# EAGLE schematic Module (EAGLE 9.5.2)

## Sheet 1 of 4: Regulator General
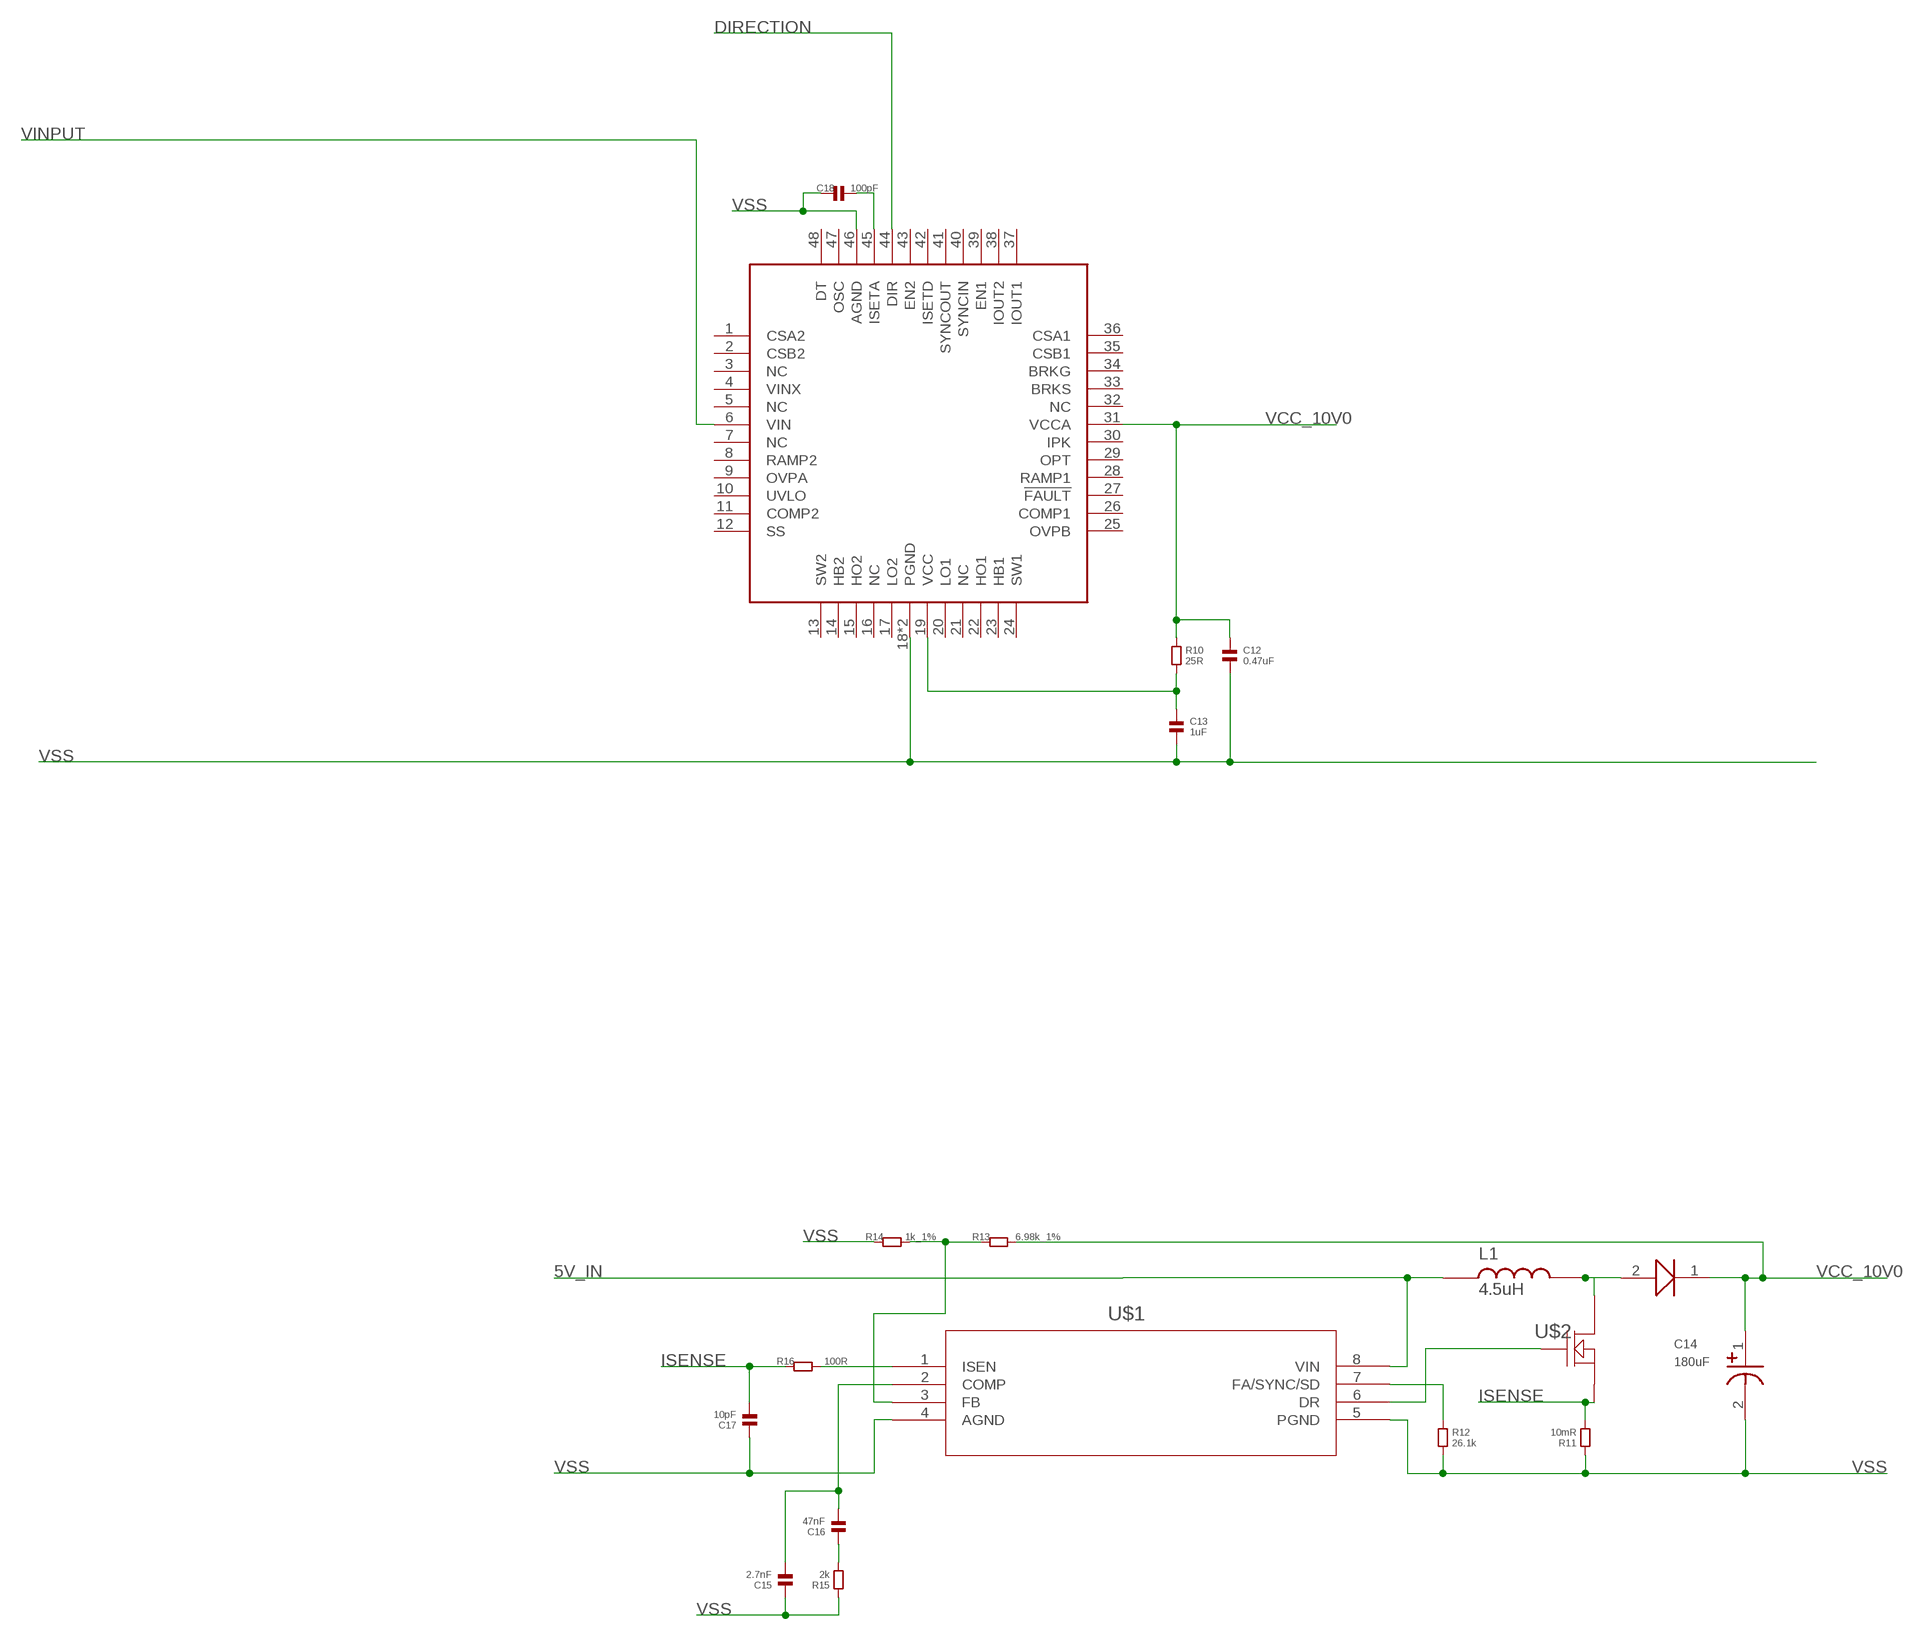
[diagram p0: schematic, sheet 1]

### Parts
C12  0.47uF  CAPACITOR.0603  [0603]
C13  1uF  CAPACITOR.0603  [0603]
C14  180uF  CAPACITOR_POLARIZED6  [ALUMINUM_ELECTROLYTIC_POLARIZED-2.5P_6.3D_11H]
C15  2.7nF  CAPACITOR.0603  [0603]
C16  47nF  CAPACITOR.0603  [0603]
C17  10pF  CAPACITOR.0603  [0603]
C18  100pF  CAPACITOR.0603  [0603]
D1  DIODES_INC-DIODE-B540C-13-F  [DIODES_INCORPORATED-DIODE-B540C-13-F]
L1  4.5uH  BOURNS-INDUCTOR-SRR1208-4R5ML  [BOURNS-INDUCTOR-SRR1208-4R5ML]
R10  25R  RESISTOR.0603  [0603]
R11  10mR  RESISTOR.1206  [1206]
R12  26.1k  RESISTOR.0603  [0603]
R13  6.98k_1%  RESISTOR.0603  [0603]
R14  1k_1%  RESISTOR.0603  [0603]
R15  2k  RESISTOR.0603  [0603]
R16  100R  RESISTOR.0603  [0603]
U1  TEXAS_INSTRUMENTS-BUCK_BOOST_CONTROLLER-LM5170  [TEXAS_INSTRUMENTS-BUCK-BOOST-CONTROLLER-LM5170]
U$1  TEXAS_INSTRUMENTS-BOOST_CONTROLLER-LM3488_DGK_8  [TEXAS_INSTRUMENTS-BOOST_CONTROLLER-LM3488_DGK_8]
U$2  TEXAS_INSTRUMENTS-MOSFET-CSD17571Q2  [TEXAS_INSTRUMENTS-MOSFET-CSD17571Q2]

### Nets
5V_IN: L1.1 U$1.8(VIN) ; also sheet 4
DIRECTION: U1.44(DIR)
ISENSE: C17.2 R11.2 R16.1 U$2.4(SOURCE_2)
N$1: D1.2(CATHODE) L1.2 U$2.1(DRAIN_2)
N$11: U$1.6(DR) U$2.3(GATE)
N$12: C13.1 R10.2 U1.19(VCC)
N$13: C18.2 U1.45(ISETA)
N$14: R12.1 U$1.7(FA/SYNC/SD)
N$15: R13.1 R14.2 U$1.3(FB)
N$16: C16.1 R15.2
N$17: C15.2 C16.2 U$1.2(COMP)
N$18: R16.2 U$1.1(ISEN)
VCC_10V0: C12.1 C14.1(+) D1.1(ANODE) R10.1 R13.2 U1.31(VCCA)
VINPUT: U1.6(VIN) ; also sheet 3
VSS: C12.2 C13.2 C14.2(-) C15.1 C17.1 C18.1 R11.1 R12.2 R14.1 R15.1 U1.18(PGND) U1.46(AGND) U1.49(PGND) U$1.4(AGND) U$1.5(PGND) ; also sheet 3,4
Unconnected: U1.1(CSA2) U1.2(CSB2) U1.3(NC) U1.4(VINX) U1.5(NC) U1.7(NC) U1.8(RAMP2) U1.9(OVPA) U1.10(UVLO) U1.11(COMP2) U1.12(SS) U1.13(SW2) U1.14(HB2) U1.15(HO2) U1.16(NC) U1.17(LO2) U1.20(LO1) U1.21(NC) U1.22(HO1) U1.23(HB1) U1.24(SW1) U1.25(OVPB) U1.26(COMP1) U1.27(!FAULT) U1.28(RAMP1) U1.29(OPT) U1.30(IPK) U1.32(NC) U1.33(BRKS) U1.34(BRKG) U1.35(CSB1) U1.36(CSA1) U1.37(IOUT1) U1.38(IOUT2) U1.39(EN1) U1.40(SYNCIN) U1.41(SYNCOUT) U1.42(ISETD) U1.43(EN2) U1.47(OSC) U1.48(DT)

## Sheet 2 of 4: MCU

## Sheet 3 of 4: eFuse
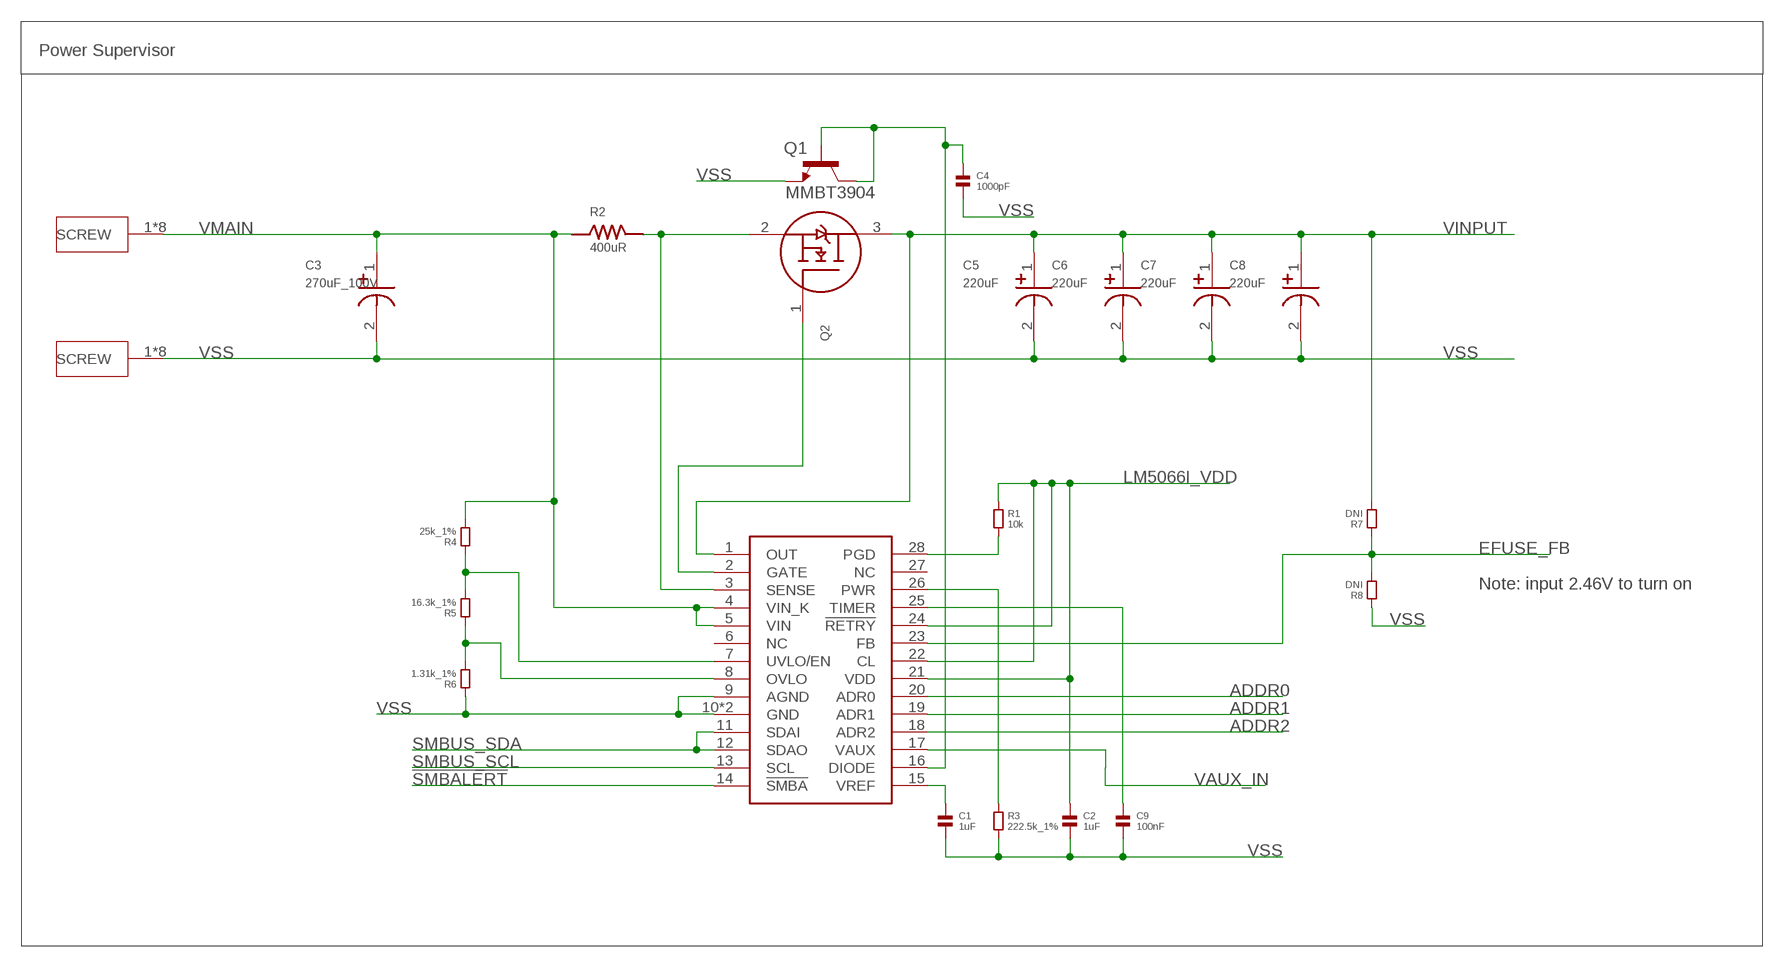
[diagram p1: schematic, sheet 3]

### Parts
C1  1uF  CAPACITOR.0603  [0603]
C2  1uF  CAPACITOR.0603  [0603]
C3  270uF_100V  CAPACITOR_POLARIZED5  [ALUMINUM_ELECTROLYTIC_POLARIZED-5P_12.5D_20H]
C4  1000pF  CAPACITOR.0603  [0603]
C5  220uF  CAPACITOR_POLARIZED5  [ALUMINUM_ELECTROLYTIC_POLARIZED-5P_12.5D_20H]
C6  220uF  CAPACITOR_POLARIZED5  [ALUMINUM_ELECTROLYTIC_POLARIZED-5P_12.5D_20H]
C7  220uF  CAPACITOR_POLARIZED5  [ALUMINUM_ELECTROLYTIC_POLARIZED-5P_12.5D_20H]
C8  220uF  CAPACITOR_POLARIZED5  [ALUMINUM_ELECTROLYTIC_POLARIZED-5P_12.5D_20H]
C9  100nF  CAPACITOR.0603  [0603]
CN1  WURTH_ELEKTRONIK-SCREW_TERMINAL-74650094R  [WURTH_ELEKTRONIK-SCREW_TERMINAL-74650094R]
CN2  WURTH_ELEKTRONIK-SCREW_TERMINAL-74650094R  [WURTH_ELEKTRONIK-SCREW_TERMINAL-74650094R]
Q1  MMBT3904  [SOT23]
Q2  IXYS-MOSFET-IXFA72N30X3  [IXYS-MOSFET-IXFA72N30X3]
R1  10k  RESISTOR.0603  [0603]
R2  400uR  ROHM_SEMICONDUCTOR-SHUNT-PSR500HTQFE0L40  [ROHM_SEMICONDUCTOR-SHUNT-PSR500HTQFE0L40]
R3  222.5k_1%  RESISTOR.0603  [0603]
R4  25k_1%  RESISTOR.0603  [0603]
R5  16.3k_1%  RESISTOR.0603  [0603]
R6  1.31k_1%  RESISTOR.0603  [0603]
R7  DNI  RESISTOR.0603  [0603]
R8  DNI  RESISTOR.0603  [0603]
U2  TEXAS_INSTRUMENTS-EFUSE-LM5066I  [TEXAS_INSTRUMENTS-EFUSE-LM5066I]

### Nets
!SMBALERT: U2.14(!SMBA)
ADDR0: U2.20(ADR0)
ADDR1: U2.19(ADR1)
ADDR2: U2.18(ADR2)
EFUSE_FB: R7.1 R8.2 U2.23(FB)
LM5066I_VDD: C2.1 R1.1 U2.21(VDD) U2.22(CL) U2.24(!RETRY)
N$2: C4.1 Q1.1(B) Q1.3(C) U2.16(DIODE)
N$3: C9.1 U2.25(TIMER)
N$4: Q2.2(SOURCE) R2.2 U2.3(SENSE)
N$5: R1.2 U2.28(PGD)
N$6: C1.1 U2.15(VREF)
N$7: Q2.1(GATE) U2.2(GATE)
N$8: R3.1 U2.26(PWR)
N$9: R5.1 R6.2 U2.8(OVLO)
N$10: R4.1 R5.2 U2.7(UVLO/EN)
SMBUS_SCL: U2.13(SCL)
SMBUS_SDA: U2.11(SDAI) U2.12(SDAO)
VAUX_IN: U2.17(VAUX)
VINPUT: C5.1(+) C6.1(+) C7.1(+) C8.1(+) Q2.3(DRAIN) R7.2 U2.1(OUT) ; also sheet 1
VMAIN: C3.1(+) CN1.1(SCREW) CN1.2(SCREW) CN1.3(SCREW) CN1.4(SCREW) CN1.5(SCREW) CN1.6(SCREW) CN1.7(SCREW) CN1.8(SCREW) R2.1 R4.2 U2.4(VIN_K) U2.5(VIN)
VSS: C1.2 C2.2 C3.2(-) C4.2 C5.2(-) C6.2(-) C7.2(-) C8.2(-) C9.2 CN2.1(SCREW) CN2.2(SCREW) CN2.3(SCREW) CN2.4(SCREW) CN2.5(SCREW) CN2.6(SCREW) CN2.7(SCREW) CN2.8(SCREW) Q1.2(E) R3.2 R6.1 R8.1 U2.9(AGND) U2.10(GND) U2.29(GND) ; also sheet 1,4
Unconnected: U2.6(NC) U2.27(NC)

### Notes on the sheet
- Power Supervisor
- Note: input 2.46V to turn on

## Sheet 4 of 4: Connectors
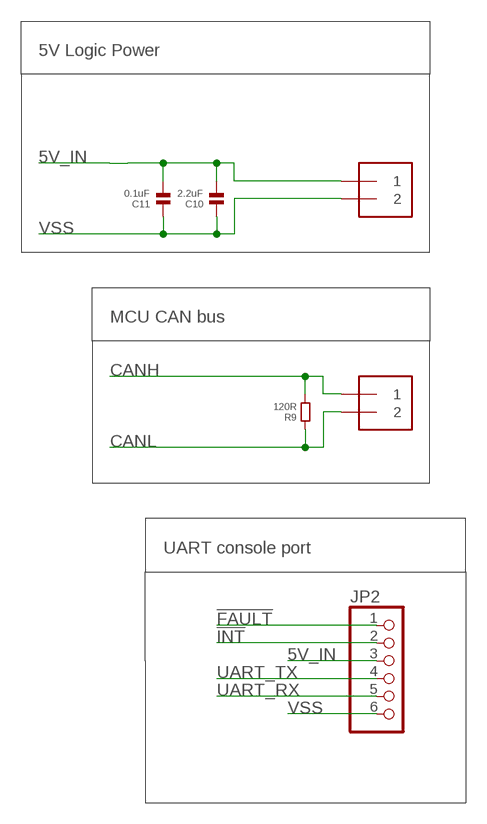
[diagram p2: schematic, sheet 4]

### Parts
C10  2.2uF  CAPACITOR.0603  [0603]
C11  0.1uF  CAPACITOR.0603  [0603]
J1  1X2-3.5MM  [1X2-3.5MM]
J2  1X2-3.5MM  [1X2-3.5MM]
JP2  PINHD-1X6  [1X06]
R9  120R  RESISTOR.0603  [0603]

### Nets
5V_IN: C10.2 C11.2 J1.1 JP2.3 ; also sheet 1
!FAULT: JP2.1
!INT: JP2.2
CANH: J2.1 R9.2
CANL: J2.2 R9.1
UART_RX: JP2.5
UART_TX: JP2.4
VSS: C10.1 C11.1 J1.2 JP2.6 ; also sheet 1,3

### Notes on the sheet
- 5V Logic Power
- MCU CAN bus
- UART console port

## Library data of the parts
C1 C2 C4 C9-C13 C15-C18 = standardparts:CAPACITOR
C3 C5-C8 C14 = Module_Capacitors:CAPACITOR_POLARIZED
CN1 CN2 = Module_Connectors:WURTH_ELEKTRONIK-SCREW_TERMINAL-74650094R
D1 = Module_Diodes:DIODES_INC-DIODE-B540C-13-F
J1 J2 = adafruit:1X2: 3.5mm Terminal block http://www.ladyada.net/library/pcb/eaglelibrary.html
JP2 = pinhead:PINHD-1X6: PIN HEADER
L1 = Module_Inductors:BOURNS-INDUCTOR-SRR1208-4R5ML
Q1 = Transistor:MMBT3904: TRANS NPN 40V 0.2A SOT-23; CREATED_BY: PCB Layout; DIGIKEY_PART_NUMBER: MMBT3904FSCT-ND; MANUFACTURER: ON Semiconductor; MPN: MMBT3904; PACKAGE: SOT-23-3
Q2 = Module_ICs:IXYS-MOSFET-IXFA72N30X3
R1 R3-R16 = standardparts:RESISTOR
R2 = Module_Resistors:ROHM_SEMICONDUCTOR-SHUNT-PSR500HTQFE0L40
U1 = Module_Regulators:TEXAS_INSTRUMENTS-BUCK_BOOST_CONTROLLER-LM5170
U2 = Module_Regulators:TEXAS_INSTRUMENTS-EFUSE-LM5066I
U$1 = Module_Regulators:TEXAS_INSTRUMENTS-BOOST_CONTROLLER-LM3488_DGK_8; MANUFACTURER_PART_NUMBER: lm3488mmnopb; VENDOR: National
U$2 = Module_ICs:TEXAS_INSTRUMENTS-MOSFET-CSD17571Q2; DATASHEETURL: httpwww.ti.comlitdssymlinkcsd17571q2.pdf; IDSMAX: 22.0; MANUFACTURER_PART_NUMBER: CSD17571Q2; QGTYP: 2.4; QUANTITY: 1; RDSON45: 0.029; VDSMAX: 30.0; VENDOR: Texas Instruments